# Altium schematic sheet TopLevel.SchDoc
size A
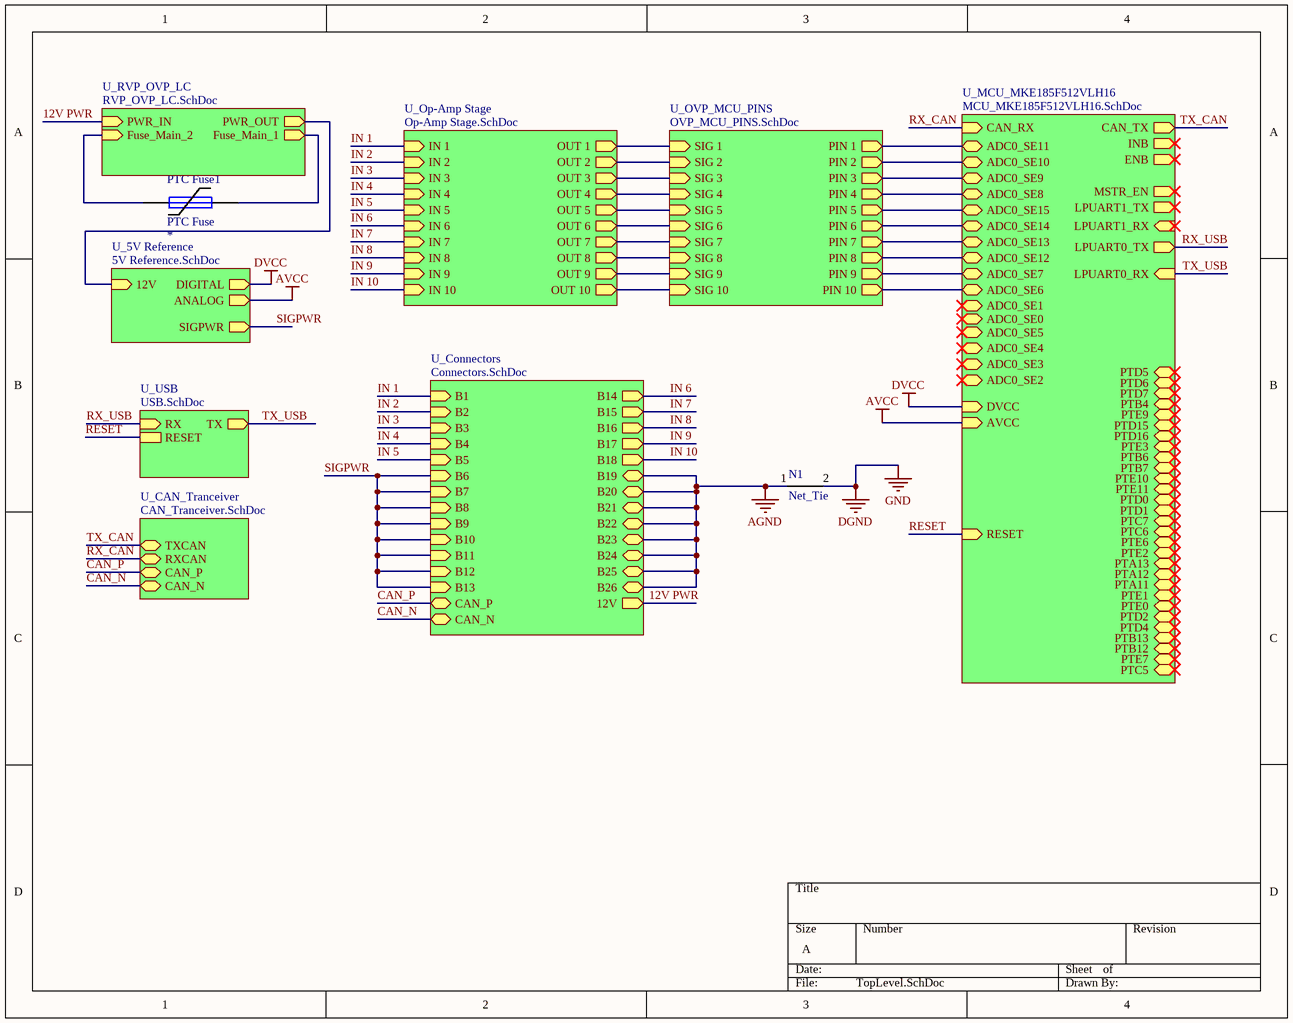
[diagram p0: TopLevel.SchDoc]

## Parts
N1  Net_Tie  [Net_Tie]  (net tie, no BOM)
PTC_Fuse1  PTC Fuse  [PTC Fuse 2920/07351]

## Sub-sheets
U_5V Reference = 5V Reference.SchDoc: 12V (in), DIGITAL (out), ANALOG (out), SIGPWR (out)
U_CAN_Tranceiver = CAN_Tranceiver.SchDoc: TXCAN (bidir), RXCAN (bidir), CAN_P (bidir), CAN_N (bidir)
U_Connectors = Connectors.SchDoc: B1 (in), B2 (in), B3 (in), B4 (in), B5 (in), B6 (in), B7 (in), B8 (in), B9 (in), B10 (in), B11 (in), B12 (in), B13 (in), B14 (out), B15 (out), B16 (out), B17 (out), B18 (out), B19 (bidir), B20 (bidir), B21 (bidir), B22 (bidir), B23 (bidir), B24 (bidir), B25 (bidir), B26 (bidir), 12V (out), CAN_N (bidir), CAN_P (bidir)
U_MCU_MKE185F512VLH16 = MCU_MKE185F512VLH16.SchDoc: CAN_TX (out), CAN_RX (in), INB (out), ENB (out), ADC0_SE11 (bidir), ADC0_SE10 (bidir), ADC0_SE9 (bidir), ADC0_SE8 (bidir), ADC0_SE15 (bidir), ADC0_SE14 (bidir), ADC0_SE13 (bidir), ADC0_SE12 (bidir), ADC0_SE7 (bidir), ADC0_SE6 (bidir), ADC0_SE1 (bidir), ADC0_SE0 (bidir), LPUART0_TX (out), LPUART0_RX (in), MSTR_EN (out), ADC0_SE5 (bidir), ADC0_SE4 (bidir), LPUART1_TX (out), LPUART1_RX (in), ADC0_SE3 (bidir), ADC0_SE2 (bidir), DVCC (in), AVCC (in), PTD5 (bidir), PTD6 (bidir), PTD7 (bidir), PTB4 (bidir), PTE9 (bidir), PTD15 (bidir), PTD16 (bidir), PTE3 (bidir), PTB6 (bidir), PTB7 (bidir), PTE10 (bidir), PTE11 (bidir), PTD0 (bidir), PTD1 (bidir), PTC7 (bidir), PTC6 (bidir), PTE6 (bidir), PTE2 (bidir), PTA13 (bidir), PTA12 (bidir), PTA11 (bidir), PTE1 (bidir), PTE0 (bidir), RESET (in), PTD2 (bidir), PTD4 (bidir), PTB13 (bidir), PTB12 (bidir), PTE7 (bidir), PTC5 (bidir)
U_Op-Amp Stage = Op-Amp Stage.SchDoc: OUT 1 (out), OUT 2 (out), OUT 3 (out), OUT 4 (out), OUT 5 (out), OUT 6 (out), OUT 7 (out), OUT 8 (out), OUT 9 (out), OUT 10 (out), IN 1 (in), IN 2 (in), IN 3 (in), IN 4 (in), IN 5 (in), IN 6 (in), IN 7 (in), IN 8 (in), IN 9 (in), IN 10 (in)
U_OVP_MCU_PINS = OVP_MCU_PINS.SchDoc: SIG 1 (in), SIG 2 (in), PIN 1 (out), PIN 2 (out), SIG 3 (in), SIG 4 (in), PIN 3 (out), PIN 4 (out), SIG 5 (in), SIG 6 (in), PIN 5 (out), PIN 6 (out), SIG 7 (in), SIG 8 (in), PIN 7 (out), PIN 8 (out), SIG 9 (in), SIG 10 (in), PIN 9 (out), PIN 10 (out)
U_RVP_OVP_LC = RVP_OVP_LC.SchDoc: PWR_IN (in), PWR_OUT (out), Fuse_Main_2 (in), Fuse_Main_1 (out)
U_USB = USB.SchDoc: TX (out), RX (in), RESET

## Nets
AGND: N1.1 ; sheet U_Connectors/B19, sheet U_Connectors/B20, sheet U_Connectors/B21, sheet U_Connectors/B22, sheet U_Connectors/B23, sheet U_Connectors/B24, sheet U_Connectors/B25, sheet U_Connectors/B26
AVCC: sheet U_5V Reference/ANALOG, sheet U_MCU_MKE185F512VLH16/AVCC
DGND: N1.2  [also labelled GND]
DVCC: sheet U_5V Reference/DIGITAL, sheet U_MCU_MKE185F512VLH16/DVCC
12V PWR: sheet U_RVP_OVP_LC/PWR_IN, sheet U_Connectors/12V
CAN_N: sheet U_CAN_Tranceiver/CAN_N, sheet U_Connectors/CAN_N
CAN_P: sheet U_CAN_Tranceiver/CAN_P, sheet U_Connectors/CAN_P
IN 1: sheet U_Connectors/B1, sheet U_Op-Amp Stage/IN 1
IN 2: sheet U_Connectors/B2, sheet U_Op-Amp Stage/IN 2
IN 3: sheet U_Connectors/B3, sheet U_Op-Amp Stage/IN 3
IN 4: sheet U_Connectors/B4, sheet U_Op-Amp Stage/IN 4
IN 5: sheet U_Connectors/B5, sheet U_Op-Amp Stage/IN 5
IN 6: sheet U_Connectors/B14, sheet U_Op-Amp Stage/IN 6
IN 7: sheet U_Connectors/B15, sheet U_Op-Amp Stage/IN 7
IN 8: sheet U_Connectors/B16, sheet U_Op-Amp Stage/IN 8
IN 9: sheet U_Connectors/B17, sheet U_Op-Amp Stage/IN 9
IN 10: sheet U_Connectors/B18, sheet U_Op-Amp Stage/IN 10
RESET: sheet U_USB/RESET, sheet U_MCU_MKE185F512VLH16/RESET
RX_CAN: sheet U_CAN_Tranceiver/RXCAN, sheet U_MCU_MKE185F512VLH16/CAN_RX
RX_USB: sheet U_USB/RX, sheet U_MCU_MKE185F512VLH16/LPUART0_TX
SIGPWR: sheet U_Connectors/B6, sheet U_Connectors/B7, sheet U_Connectors/B8, sheet U_Connectors/B9, sheet U_Connectors/B10, sheet U_Connectors/B11, sheet U_Connectors/B12, sheet U_Connectors/B13, sheet U_5V Reference/SIGPWR
TX_CAN: sheet U_CAN_Tranceiver/TXCAN, sheet U_MCU_MKE185F512VLH16/CAN_TX
TX_USB: sheet U_USB/TX, sheet U_MCU_MKE185F512VLH16/LPUART0_RX
NetPTC_Fuse1_1: PTC_Fuse1.1 ; sheet U_RVP_OVP_LC/Fuse_Main_2
NetPTC_Fuse1_2: PTC_Fuse1.2 ; sheet U_RVP_OVP_LC/Fuse_Main_1
(unnamed): sheet U_RVP_OVP_LC/PWR_OUT, sheet U_5V Reference/12V
(unnamed): sheet U_OVP_MCU_PINS/SIG 1, sheet U_Op-Amp Stage/OUT 1
(unnamed): sheet U_OVP_MCU_PINS/SIG 2, sheet U_Op-Amp Stage/OUT 2
(unnamed): sheet U_OVP_MCU_PINS/PIN 1, sheet U_MCU_MKE185F512VLH16/ADC0_SE11
(unnamed): sheet U_OVP_MCU_PINS/PIN 2, sheet U_MCU_MKE185F512VLH16/ADC0_SE10
(unnamed): sheet U_OVP_MCU_PINS/SIG 3, sheet U_Op-Amp Stage/OUT 3
(unnamed): sheet U_OVP_MCU_PINS/SIG 4, sheet U_Op-Amp Stage/OUT 4
(unnamed): sheet U_OVP_MCU_PINS/PIN 3, sheet U_MCU_MKE185F512VLH16/ADC0_SE9
(unnamed): sheet U_OVP_MCU_PINS/PIN 4, sheet U_MCU_MKE185F512VLH16/ADC0_SE8
(unnamed): sheet U_OVP_MCU_PINS/SIG 5, sheet U_Op-Amp Stage/OUT 5
(unnamed): sheet U_OVP_MCU_PINS/SIG 6, sheet U_Op-Amp Stage/OUT 6
(unnamed): sheet U_OVP_MCU_PINS/PIN 5, sheet U_MCU_MKE185F512VLH16/ADC0_SE15
(unnamed): sheet U_OVP_MCU_PINS/PIN 6, sheet U_MCU_MKE185F512VLH16/ADC0_SE14
(unnamed): sheet U_OVP_MCU_PINS/SIG 7, sheet U_Op-Amp Stage/OUT 7
(unnamed): sheet U_OVP_MCU_PINS/SIG 8, sheet U_Op-Amp Stage/OUT 8
(unnamed): sheet U_OVP_MCU_PINS/PIN 7, sheet U_MCU_MKE185F512VLH16/ADC0_SE13
(unnamed): sheet U_OVP_MCU_PINS/PIN 8, sheet U_MCU_MKE185F512VLH16/ADC0_SE12
(unnamed): sheet U_OVP_MCU_PINS/SIG 9, sheet U_Op-Amp Stage/OUT 9
(unnamed): sheet U_OVP_MCU_PINS/SIG 10, sheet U_Op-Amp Stage/OUT 10
(unnamed): sheet U_OVP_MCU_PINS/PIN 9, sheet U_MCU_MKE185F512VLH16/ADC0_SE7
(unnamed): sheet U_OVP_MCU_PINS/PIN 10, sheet U_MCU_MKE185F512VLH16/ADC0_SE6

## Library data of the parts
N1 = 1: Manufacturer_id: 1; idFuse: 3; Name: Net Tie; Drawer_id: 1; idShunt: 1
PTC_Fuse1 = 4: Fuse; Manufacturer_id: 1; MfrPartNo: 2920L200; idFuse: 4; Name: PTC Poly Fuse Resettable; Value: 2A hold, 4A trip, 40A max; I_hold: 2A; I_trip: 4A; I_max: 40A; Created_By: Eunice Bernardo; Published: 8-Jun-2000; LatestRevisionDate: 17-Jul-2002; LatestRevisionNote: Re-released for DXP Platform.; PackageReference: PIN-W2/E2.8; Publisher: Altium Limited; PackageDescription: Thru-Hole; 2 Leads; I-hold: *; Drawer_id: 1; Link: https://www.digikey.com/product-detail/en/littelfuse-inc/2920L200-24DR/F2872TR-ND/1211346; Created_Date: 10/27/2018